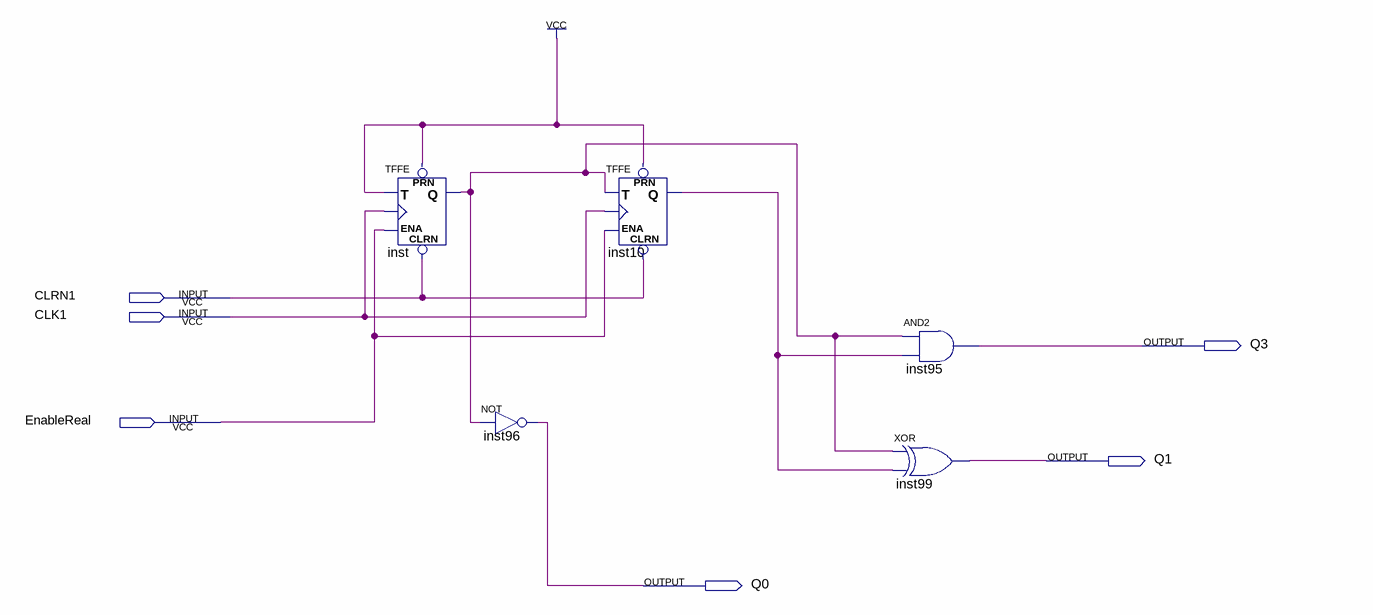
[diagram p0: schematic sheet]
// Quartus schematic twoBitUpCounterREAL.bdf as structural Verilog: 5 symbols, 6 pins
module twoBitUpCounterREAL (
  input  CLRN1,
  input  CLK1,
  input  EnableReal,
  output Q3,
  output Q1,
  output Q0
);

  wire inst10_q, inst_q;

  TFFE inst (.CLRN(CLRN1), .T(1'b1), .CLK(CLK1), .ENA(EnableReal), .PRN(1'b1), .Q(inst_q));
  not inst96 (Q0, inst_q);
  TFFE inst10 (.CLRN(CLRN1), .T(inst_q), .CLK(CLK1), .ENA(EnableReal), .PRN(1'b1), .Q(inst10_q));
  and inst95 (Q3, inst_q, inst10_q);
  xor inst99 (Q1, inst_q, inst10_q);
endmodule
